# Altium schematic sheet CPU - Control.SchDoc: Title
size Tabloid; Revision: A; ProjectTitle: CDU: CAN Display Unit
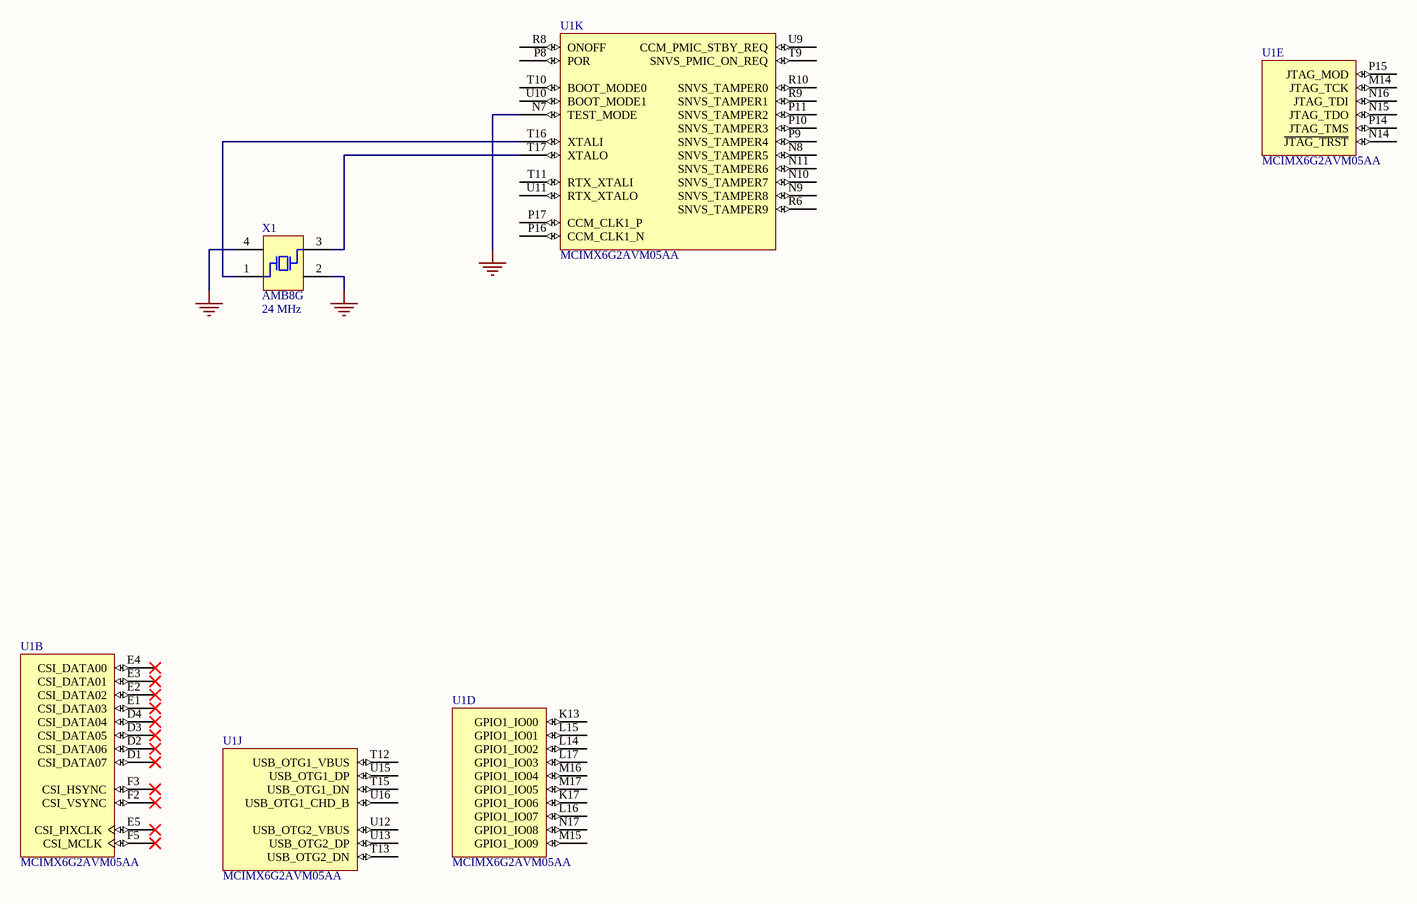
[diagram p0: CPU - Control.SchDoc]

## Parts
U1  MCIMX6G2AVM05AA  [BGA289C80P17X17_1400X1400X132]  (parts B,D,E,J,K of 14)
X1  AMB8G  value 24 MHz  [DFN220P320X100-4N]

## Nets
GND: U1.N7(TEST_MODE) X1.2 X1.4
NetU1_T16: U1.T16(XTALI) X1.1
NetU1_T17: U1.T17(XTALO) X1.3

Not connected (* = marked no-connect by the designer): U1 D1(CSI_DATA07)* D2(CSI_DATA06)* D3(CSI_DATA05)* D4(CSI_DATA04)* E1(CSI_DATA03)* E2(CSI_DATA02)* E3(CSI_DATA01)* E4(CSI_DATA00)* E5(CSI_PIXCLK)* F2(CSI_VSYNC)* F3(CSI_HSYNC)* F5(CSI_MCLK)* K13(GPIO1_IO00) K17(GPIO1_IO06) L14(GPIO1_IO02) L15(GPIO1_IO01) L16(GPIO1_IO07) L17(GPIO1_IO03) M14(JTAG_TCK) M15(GPIO1_IO09) M16(GPIO1_IO04) M17(GPIO1_IO05) N8(SNVS_TAMPER5) N9(SNVS_TAMPER8) N10(SNVS_TAMPER7) N11(SNVS_TAMPER6) N14(~{JTAG_TRST}) N15(JTAG_TDO) N16(JTAG_TDI) N17(GPIO1_IO08) P8(POR) P9(SNVS_TAMPER4) P10(SNVS_TAMPER3) P11(SNVS_TAMPER2) P14(JTAG_TMS) P15(JTAG_MOD) P16(CCM_CLK1_N) P17(CCM_CLK1_P) R6(SNVS_TAMPER9) R8(ONOFF) R9(SNVS_TAMPER1) R10(SNVS_TAMPER0) T9(SNVS_PMIC_ON_REQ) T10(BOOT_MODE0) T11(RTX_XTALI) T12(USB_OTG1_VBUS) T13(USB_OTG2_DN) T15(USB_OTG1_DN) U9(CCM_PMIC_STBY_REQ) U10(BOOT_MODE1) U11(RTX_XTALO) U12(USB_OTG2_VBUS) U13(USB_OTG2_DP) U15(USB_OTG1_DP) U16(USB_OTG1_CHD_B)

## Notes on the sheet
- Date:
- Revision:
- Sheet:
- /

## Library data of the parts
X1 = ABM8G-24.000MHZ-18-D2Y-T